# EAGLE schematic SS (EAGLE 9.3.0)
REVISION: A
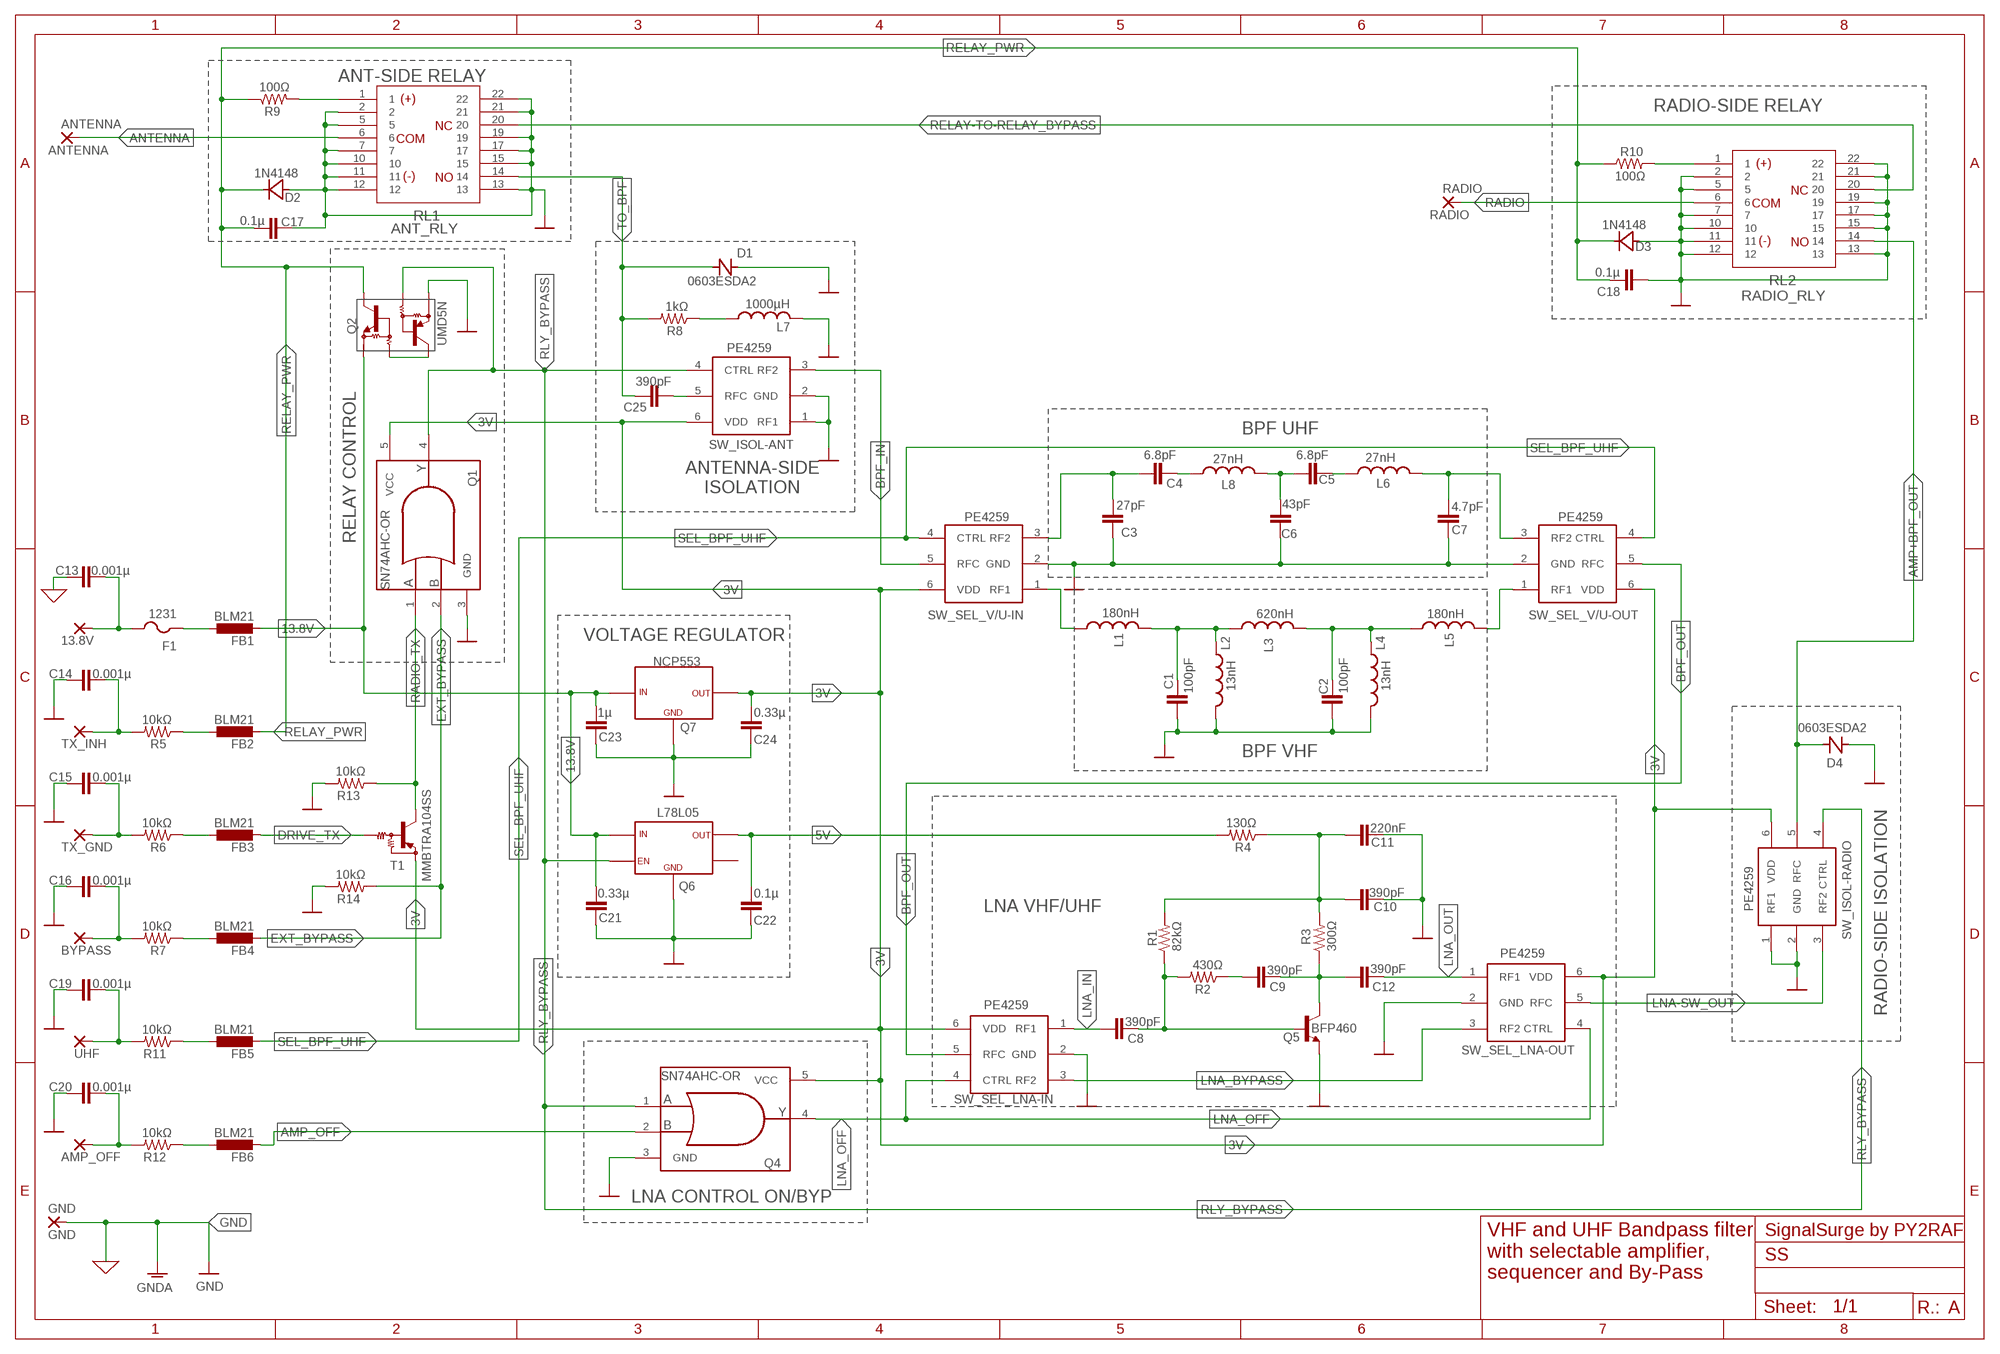
[diagram p0: schematic, sheet 1]

## Parts
13.8V  13.8V  SMD2  [SMD1,27-2,54]
AMP_OFF  AMP_OFF  SMD2  [SMD1,27-2,54]
ANTENNA  ANTENNA  SMD2  [SMD1,27-2,54]
BYPASS  BYPASS  SMD2  [SMD1,27-2,54]
C1  100pF  MURATACAP  [GRM18]
C2  100pF  MURATACAP  [GRM18]
C3  27pF  MURATACAP  [GRM18]
C4  6.8pF  MURATACAP  [GRM18]
C5  6.8pF  MURATACAP  [GRM18]
C6  43pF  MURATACAP  [GRM18]
C7  4.7pF  MURATACAP  [GRM18]
C8  390pF  MURATACAP  [GRM18]
C9  390pF  MURATACAP  [GRM18]
C10  390pF  MURATACAP  [GRM18]
C11  220nF  MURATACAP  [GRM18]
C12  390pF  MURATACAP  [GRM18]
C13  0.001µ  C-EUC0805  [C0805]
C14  0.001µ  C-EUC0805  [C0805]
C15  0.001µ  C-EUC0805  [C0805]
C16  0.001µ  C-EUC0805  [C0805]
C17  0.1µ  C-EUC0805  [C0805]
C18  0.1µ  C-EUC0805  [C0805]
C19  0.001µ  C-EUC0805  [C0805]
C20  0.001µ  C-EUC0805  [C0805]
C21  0.33µ  C-EUC0805  [C0805]
C22  0.1µ  C-EUC0805  [C0805]
C23  1µ  C-EUC0805  [C0805]
C24  0.33µ  C-EUC0805  [C0805]
C25  390pF  MURATACAP  [GRM18]
D1  0603ESDA2  [0603]
D2  1N4148  D-SOD323  [SOD-323]
D3  1N4148  D-SOD323  [SOD-323]
D4  0603ESDA2  [0603]
F1  1231  PTCFUSE-1206  [R1206]
FB1  BLM21  FB-0805  [0805]
FB2  BLM21  FB-0805  [0805]
FB3  BLM21  FB-0805  [0805]
FB4  BLM21  FB-0805  [0805]
FB5  BLM21  FB-0805  [0805]
FB6  BLM21  FB-0805  [0805]
GND  GND  SMD2  [SMD1,27-2,54]
L1  180nH  L-0805  [0805]
L2  13nH  L-0805  [0805]
L3  620nH  L-0805  [0805]
L4  13nH  L-0805  [0805]
L5  180nH  L-0805  [0805]
L6  27nH  L-0805  [0805]
L7  1000µH  L-0805  [0805]
L8  27nH  L-0805  [0805]
Q1  SN74AHC-OR  [SC70-5]
Q2  UMD5N  [SOT363]
Q4  SN74AHC-OR  [SC70-5]
Q5  BFP460  BFR193F  [TSFP-3]
Q6  L78L05  MIC5365  [SOT23-5L]
Q7  NCP553  [SC-82AB]
R1  82kΩ  R-US_M1206  [M1206]
R2  430Ω  R-US_M1206  [M1206]
R3  300Ω  R-US_M1206  [M1206]
R4  130Ω  R-US_M1206  [M1206]
R5  10kΩ  R-US_M1206  [M1206]
R6  10kΩ  R-US_M1206  [M1206]
R7  10kΩ  R-US_M1206  [M1206]
R8  1kΩ  R-US_M1206  [M1206]
R9  100Ω  R-US_M1206  [M1206]
R10  100Ω  R-US_M1206  [M1206]
R11  10kΩ  R-US_M1206  [M1206]
R12  10kΩ  R-US_M1206  [M1206]
R13  10kΩ  R-US_M1206  [M1206]
R14  10kΩ  R-US_M1206  [M1206]
RADIO  RADIO  SMD2  [SMD1,27-2,54]
RL1  ANT_RLY  RELAY-TE-HF3  [RELAY-TE-HF3]
RL2  RADIO_RLY  RELAY-TE-HF3  [RELAY-TE-HF3]
SW_ISOL-ANT  PE4259  [SC-70]
SW_ISOL-RADIO  PE4259  [SC-70]
SW_SEL_LNA-IN  PE4259  [SC-70]
SW_SEL_LNA-OUT  PE4259  [SC-70]
SW_SEL_V/U-IN  PE4259  [SC-70]
SW_SEL_V/U-OUT  PE4259  [SC-70]
T1  MMBTRA104SS  MUN2111T1-PNP_DRIVER-SC59-BEC  [SC59-BEC]
TX_GND  TX_GND  SMD2  [SMD1,27-2,54]
TX_INH  TX INH  SMD2  [SMD1,27-2,54]
UHF  UHF  SMD2  [SMD1,27-2,54]

## Nets
0: C13.1 ; supply symbol labelled GND
3V: C24.2 Q1.5(VCC) Q4.5(VCC) Q7.3(OUT) SW_ISOL-ANT.6(VDD) SW_ISOL-RADIO.6(VDD) SW_SEL_LNA-IN.6(VDD) SW_SEL_LNA-OUT.6(VDD) SW_SEL_V/U-IN.6(VDD) SW_SEL_V/U-OUT.6(VDD) T1.E
5V: C22.2 Q6.5(VOUT) R4.2
13.8V: C21.2 C23.2 FB1.P$2 Q2.1 Q6.1(VIN) Q7.2(IN)
AMP+BPF_OUT: D4.2(C) RL2.14 SW_ISOL-RADIO.5(RFC)
AMP_OFF: FB6.P$2 Q4.2(B)
ANTENNA: ANTENNA.1(P) RL1.6
BPF_IN: SW_ISOL-ANT.3(RF2) SW_SEL_V/U-IN.5(RFC)
BPF_OUT: SW_SEL_LNA-IN.5(RFC) SW_SEL_V/U-OUT.5(RFC)
DRIVE_TX: FB3.P$2 T1.B
EXT_BYPASS: FB4.P$2 Q1.2(B) R14.1
GND: C1.P$1 C2.P$1 C3.P$1 C6.P$1 C7.P$1 C10.P$2 C11.P$2 C14.1 C15.1 C16.1 C17.1 C18.2 C19.1 C20.1 C21.1 C22.1 C23.1 C24.1 D1.1(A) D2.A D3.A D4.1(A) GND.1(P) L2.P$2 L4.P$2 L7.P$2 Q1.3(GND) Q2.6 Q4.3(GND) Q5.2(E) Q6.2(GND) Q7.1(GN) R13.2 R14.2 RL1.2 RL1.5 RL1.7 RL1.10 RL1.11 RL1.12 RL1.13 RL1.15 RL1.17 RL1.19 RL1.21 RL1.22 RL2.2 RL2.5 RL2.7 RL2.10 RL2.11 RL2.12 RL2.13 RL2.15 RL2.17 RL2.19 RL2.21 RL2.22 SW_ISOL-ANT.1(RF1) SW_ISOL-ANT.2(GND) SW_ISOL-RADIO.1(RF1) SW_ISOL-RADIO.2(GND) SW_SEL_LNA-IN.2(GND) SW_SEL_LNA-OUT.2(GND) SW_SEL_V/U-IN.2(GND) SW_SEL_V/U-OUT.2(GND) ; supply symbol labelled GNDA
LNA-SW_OUT: SW_ISOL-RADIO.3(RF2) SW_SEL_LNA-OUT.5(RFC)
LNA_BYPASS: SW_SEL_LNA-IN.3(RF2) SW_SEL_LNA-OUT.3(RF2)
LNA_IN: C8.P$1 SW_SEL_LNA-IN.1(RF1)
LNA_OFF: Q4.4(Y) SW_SEL_LNA-IN.4(CTRL) SW_SEL_LNA-OUT.4(CTRL)
LNA_OUT: C12.P$2 SW_SEL_LNA-OUT.1(RF1)
N$1: R9.2 RL1.1
N$2: L7.P$1 R8.1
N$3: L1.P$1 SW_SEL_V/U-IN.1(RF1)
N$4: C3.P$2 C4.P$1 SW_SEL_V/U-IN.3(RF2)
N$5: C1.P$2 L1.P$2 L2.P$1 L3.P$1
N$6: C25.P$2 SW_ISOL-ANT.5(RFC)
N$7: L5.P$2 SW_SEL_V/U-OUT.1(RF1)
N$9: 13.8V.1(P) C13.2 F1.2
N$10: BYPASS.1(P) C16.2 R7.2
N$12: C19.2 R11.2 UHF.1(P)
N$13: F1.1 FB1.P$1
N$14: C2.P$2 L3.P$2 L4.P$1 L5.P$1
N$15: AMP_OFF.1(P) C20.2 R12.2
N$16: C15.2 R6.2 TX_GND.1(P)
N$17: C8.P$2 Q5.1(B) R1.1 R2.2
N$18: C4.P$2 L8.P$1
N$19: C5.P$1 C6.P$2 L8.P$2
N$20: C5.P$2 L6.P$1
N$21: C7.P$2 L6.P$2 SW_SEL_V/U-OUT.3(RF2)
N$22: C9.P$1 R2.1
N$24: C10.P$1 C11.P$1 R1.2 R3.2 R4.1
N$25: C9.P$2 C12.P$1 Q5.3(C) R3.1
N$26: C14.2 R5.2 TX_INH.1(P)
N$27: FB2.P$1 R5.1
N$28: FB3.P$1 R6.1
N$30: R10.2 RL2.1
N$32: FB4.P$1 R7.1
N$36: Q2.2 Q2.3
N$42: FB5.P$1 R11.1
N$45: FB6.P$1 R12.1
RADIO: RADIO.1(P) RL2.6
RADIO_TX: Q1.1(A) R13.1 T1.C
RELAY-TO-RELAY_BYPASS: RL1.20 RL2.20
RELAY_PWR: C17.2 C18.1 D2.C D3.C FB2.P$2 Q2.4 R9.1 R10.1
RLY_BYPASS: Q1.4(Y) Q2.5 Q4.1(A) Q6.3(EN) SW_ISOL-ANT.4(CTRL) SW_ISOL-RADIO.4(CTRL)
SEL_BPF_UHF: FB5.P$2 SW_SEL_V/U-IN.4(CTRL) SW_SEL_V/U-OUT.4(CTRL)
TO_BPF: C25.P$1 D1.2(C) R8.2 RL1.14
Unconnected: Q6.4(NC)

## Notes on the sheet
- ANT-SIDE RELAY
- RADIO-SIDE RELAY
- BPF UHF
- ANTENNA-SIDE
  ISOLATION
- RELAY CONTROL
- VOLTAGE REGULATOR
- BPF VHF
- LNA VHF/UHF
- RADIO-SIDE ISOLATION
- LNA CONTROL ON/BYP
- VHF and UHF Bandpass filter
  with selectable amplifier,
  sequencer and By-Pass
- SignalSurge by PY2RAF
- R.:

## Library data of the parts
13.8V TX_INH = wirepad:SMD2: SMD PAD; SPICEPREFIX: X
AMP_OFF ANTENNA BYPASS GND RADIO TX_GND UHF = wirepad:SMD2: SMD PAD
C1-C12 C25 = aarf:MURATACAP: Murata GQM GR3 GRJ GRM 18 Capacitors
C13-C24 = rcl:C-EU: CAPACITOR, European symbol; SPICEPREFIX: C
D1 D4 = aarf:0603ESDA2: 0603ESDA2-TR2 • Lead free, halogen free materials • 0603/1608 footprint surface mount device • Ideal ESD protection for high frequency, low voltage applications • Exceeds testing requirements of IEC 61000-4-2 • Ultra low capacitance (0.15pF maximum) • Very low leakage current • Fast response time • Bi-directional
D2 D3 = aarf:D-SOD323: Diode - SOD323
F1 = adafruit:PTCFUSE: PTC fuses, resettable thermistors; SPICEPREFIX: B
FB1-FB6 = aarf:FB-0805: Ferrite Bead - 0805
L1-L8 = aarf:L-0805: Inductor - L - Footprint 0805
Q1 Q4 = aarf:SN74AHC-OR: SN74AHC1G32
Q2 = aarf:UMD5N
Q5 = aarf:BFR193F: Infineon BFR193F RF Transistor
Q6 = aarf:MIC5365
Q7 = aarf:NCP553
R1-R14 = rcl:R-US_: RESISTOR, American symbol; SPICEPREFIX: R
RL1 RL2 = aarf:RELAY-TE-HF3; IMPEDANCE: 50R
SW_ISOL-ANT SW_ISOL-RADIO SW_SEL_LNA-IN SW_SEL_LNA-OUT SW_SEL_V/U-IN SW_SEL_V/U-OUT = aarf:PE4259: PE4259 SPDT High Power UltraCMOS 10 MHz 3.0 GHz RF Switch Features - High ESD tolerance of 2 kV HBM - Single-pin or complementary CMOS logic control inputs - Low insertion loss: * 0.35 dB @ 1000 MHz * 0.5 dB @ 2000 MHz - Isolation of 30 dB @ 1000 MHz - Typical input 1 dB compression point of +33.5 dBm - 1.8V minimum power supply voltage - Ultra-small SC-70 package
T1 = transistor:*-PNP_DRIVER-: PNP Bias Resistor Transistor